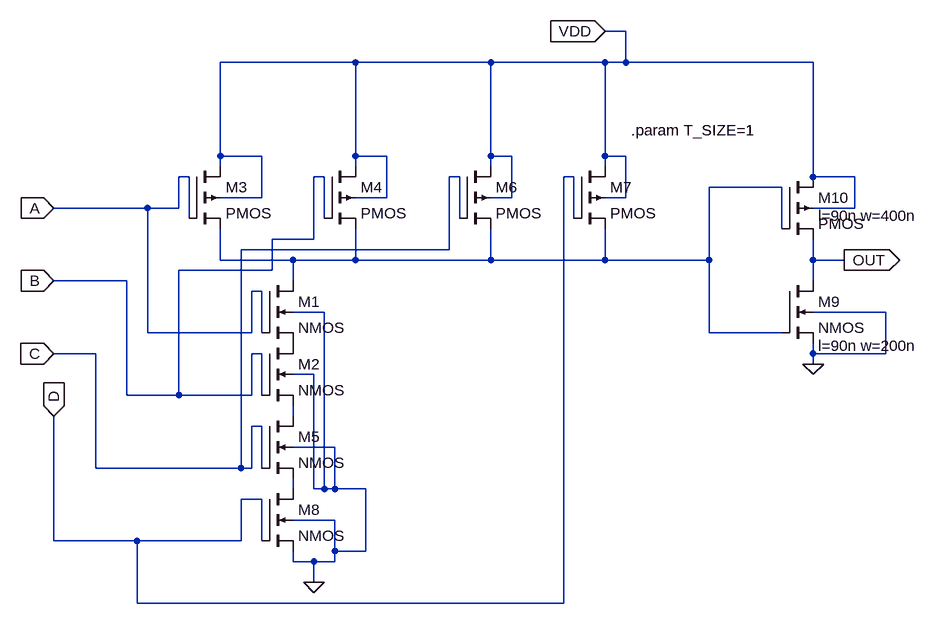
[diagram p0: schematic and4.asc]
and4.asc, the LTspice schematic file:
Version 4
SHEET 1 1276 740
WIRE 480 -256 448 -256
WIRE 64 -208 -144 -208
WIRE 272 -208 64 -208
WIRE 448 -208 272 -208
WIRE 480 -208 480 -256
WIRE 480 -208 448 -208
WIRE 768 -208 480 -208
WIRE -144 -64 -144 -208
WIRE -80 -64 -144 -64
WIRE 64 -64 64 -208
WIRE 112 -64 64 -64
WIRE 272 -64 272 -208
WIRE 304 -64 272 -64
WIRE 448 -64 448 -208
WIRE 480 -64 448 -64
WIRE -144 -48 -144 -64
WIRE 64 -48 64 -64
WIRE 272 -48 272 -64
WIRE 448 -48 448 -64
WIRE -192 -32 -208 -32
WIRE 16 -32 0 -32
WIRE 224 -32 208 -32
WIRE 400 -32 384 -32
WIRE 768 -32 768 -208
WIRE 832 -32 768 -32
WIRE 720 -16 608 -16
WIRE -80 0 -80 -64
WIRE -80 0 -144 0
WIRE 112 0 112 -64
WIRE 112 0 64 0
WIRE 304 0 304 -64
WIRE 304 0 272 0
WIRE 480 0 480 -64
WIRE 480 0 448 0
WIRE -256 16 -400 16
WIRE -208 16 -208 -32
WIRE -208 16 -256 16
WIRE 832 16 832 -32
WIRE 832 16 768 16
WIRE -192 32 -192 -32
WIRE 16 32 16 -32
WIRE 224 32 224 -32
WIRE 400 32 400 -32
WIRE 720 48 720 -16
WIRE 0 64 0 -32
WIRE 0 64 -64 64
WIRE 208 80 208 -32
WIRE 208 80 -112 80
WIRE -144 96 -144 48
WIRE -32 96 -144 96
WIRE 64 96 64 48
WIRE 64 96 -32 96
WIRE 272 96 272 48
WIRE 272 96 64 96
WIRE 448 96 448 48
WIRE 448 96 272 96
WIRE 608 96 608 -16
WIRE 608 96 448 96
WIRE 768 96 768 64
WIRE 816 96 768 96
WIRE -64 112 -64 64
WIRE -64 112 -208 112
WIRE -288 128 -400 128
WIRE -32 128 -32 96
WIRE 768 128 768 96
WIRE -80 144 -96 144
WIRE 16 176 -32 176
WIRE 880 176 768 176
WIRE -256 208 -256 16
WIRE -96 208 -96 144
WIRE -96 208 -256 208
WIRE -80 208 -80 144
WIRE 608 208 608 96
WIRE 720 208 608 208
WIRE -336 240 -400 240
WIRE -80 240 -96 240
WIRE 768 240 768 224
WIRE 880 240 880 176
WIRE 880 240 768 240
WIRE 768 256 768 240
WIRE 0 272 -32 272
WIRE -288 304 -288 128
WIRE -208 304 -208 112
WIRE -208 304 -288 304
WIRE -96 304 -96 240
WIRE -96 304 -208 304
WIRE -80 304 -80 240
WIRE -32 336 -32 320
WIRE -80 352 -96 352
WIRE 32 384 -32 384
WIRE -336 416 -336 240
WIRE -112 416 -112 80
WIRE -112 416 -336 416
WIRE -96 416 -96 352
WIRE -96 416 -112 416
WIRE -80 416 -80 352
WIRE -32 448 -32 432
WIRE 0 448 0 272
WIRE 16 448 16 176
WIRE 16 448 0 448
WIRE 32 448 32 384
WIRE 32 448 16 448
WIRE 80 448 32 448
WIRE -80 464 -112 464
WIRE 32 496 -32 496
WIRE -400 528 -400 336
WIRE -272 528 -400 528
WIRE -112 528 -112 464
WIRE -112 528 -272 528
WIRE -80 528 -80 464
WIRE 32 544 32 496
WIRE 80 544 80 448
WIRE 80 544 32 544
WIRE -32 560 -32 544
WIRE 0 560 -32 560
WIRE 32 560 32 544
WIRE 32 560 0 560
WIRE 0 592 0 560
WIRE -272 624 -272 528
WIRE 384 624 384 -32
WIRE 384 624 -272 624
FLAG -400 16 A
IOPIN -400 16 In
FLAG -400 128 B
IOPIN -400 128 In
FLAG -400 240 C
IOPIN -400 240 In
FLAG -400 336 D
IOPIN -400 336 In
FLAG 0 592 0
FLAG 768 256 0
FLAG 816 96 OUT
IOPIN 816 96 Out
FLAG 448 -256 VDD
IOPIN 448 -256 In
SYMBOL nmos4 -80 128 R0
SYMATTR InstName M1
SYMATTR Value2 l=90n w=200n
SYMBOL nmos4 -80 224 R0
SYMATTR InstName M2
SYMATTR Value2 l=90n w=200n
SYMBOL pmos4 -192 -48 R0
SYMATTR InstName M3
SYMATTR Value2 l=90n w=400n
SYMBOL pmos4 16 -48 R0
SYMATTR InstName M4
SYMATTR Value2 l=90n w=400n
SYMBOL nmos4 -80 336 R0
SYMATTR InstName M5
SYMATTR Value2 l=90n w=200n
SYMBOL pmos4 224 -48 R0
SYMATTR InstName M6
SYMATTR Value2 l=90n w=400n
SYMBOL pmos4 400 -48 R0
SYMATTR InstName M7
SYMATTR Value2 l=90n w=400n
SYMBOL nmos4 -80 448 R0
SYMATTR InstName M8
SYMATTR Value2 l=90n w=200n
SYMBOL nmos4 720 128 R0
WINDOW 123 56 100 Left 2
SYMATTR Value2 l=90n w=200n
SYMATTR InstName M9
SYMBOL pmos4 720 -32 R0
WINDOW 123 56 60 Left 2
SYMATTR Value2 l=90n w=400n
SYMATTR InstName M10
TEXT 488 -104 Left 2 !.param T_SIZE=1

The netlist it stands for:
* and4.asc
M1 N001 A P001 0 NMOS l=90n w=200n
M2 P001 B N002 0 NMOS l=90n w=200n
M3 VDD A N001 VDD PMOS l=90n w=400n
M4 VDD B N001 VDD PMOS l=90n w=400n
M5 N002 C N003 0 NMOS l=90n w=200n
M6 VDD C N001 VDD PMOS l=90n w=400n
M7 VDD D N001 VDD PMOS l=90n w=400n
M8 N003 D 0 0 NMOS l=90n w=200n
M9 OUT N001 0 0 NMOS l=90n w=200n
M10 VDD N001 OUT VDD PMOS l=90n w=400n
.model NMOS NMOS
.model PMOS PMOS
.lib standard.mos
.param T_SIZE=1
.backanno
.end